# EasyEDA Pro project legacy_final.eprj, board PCB7
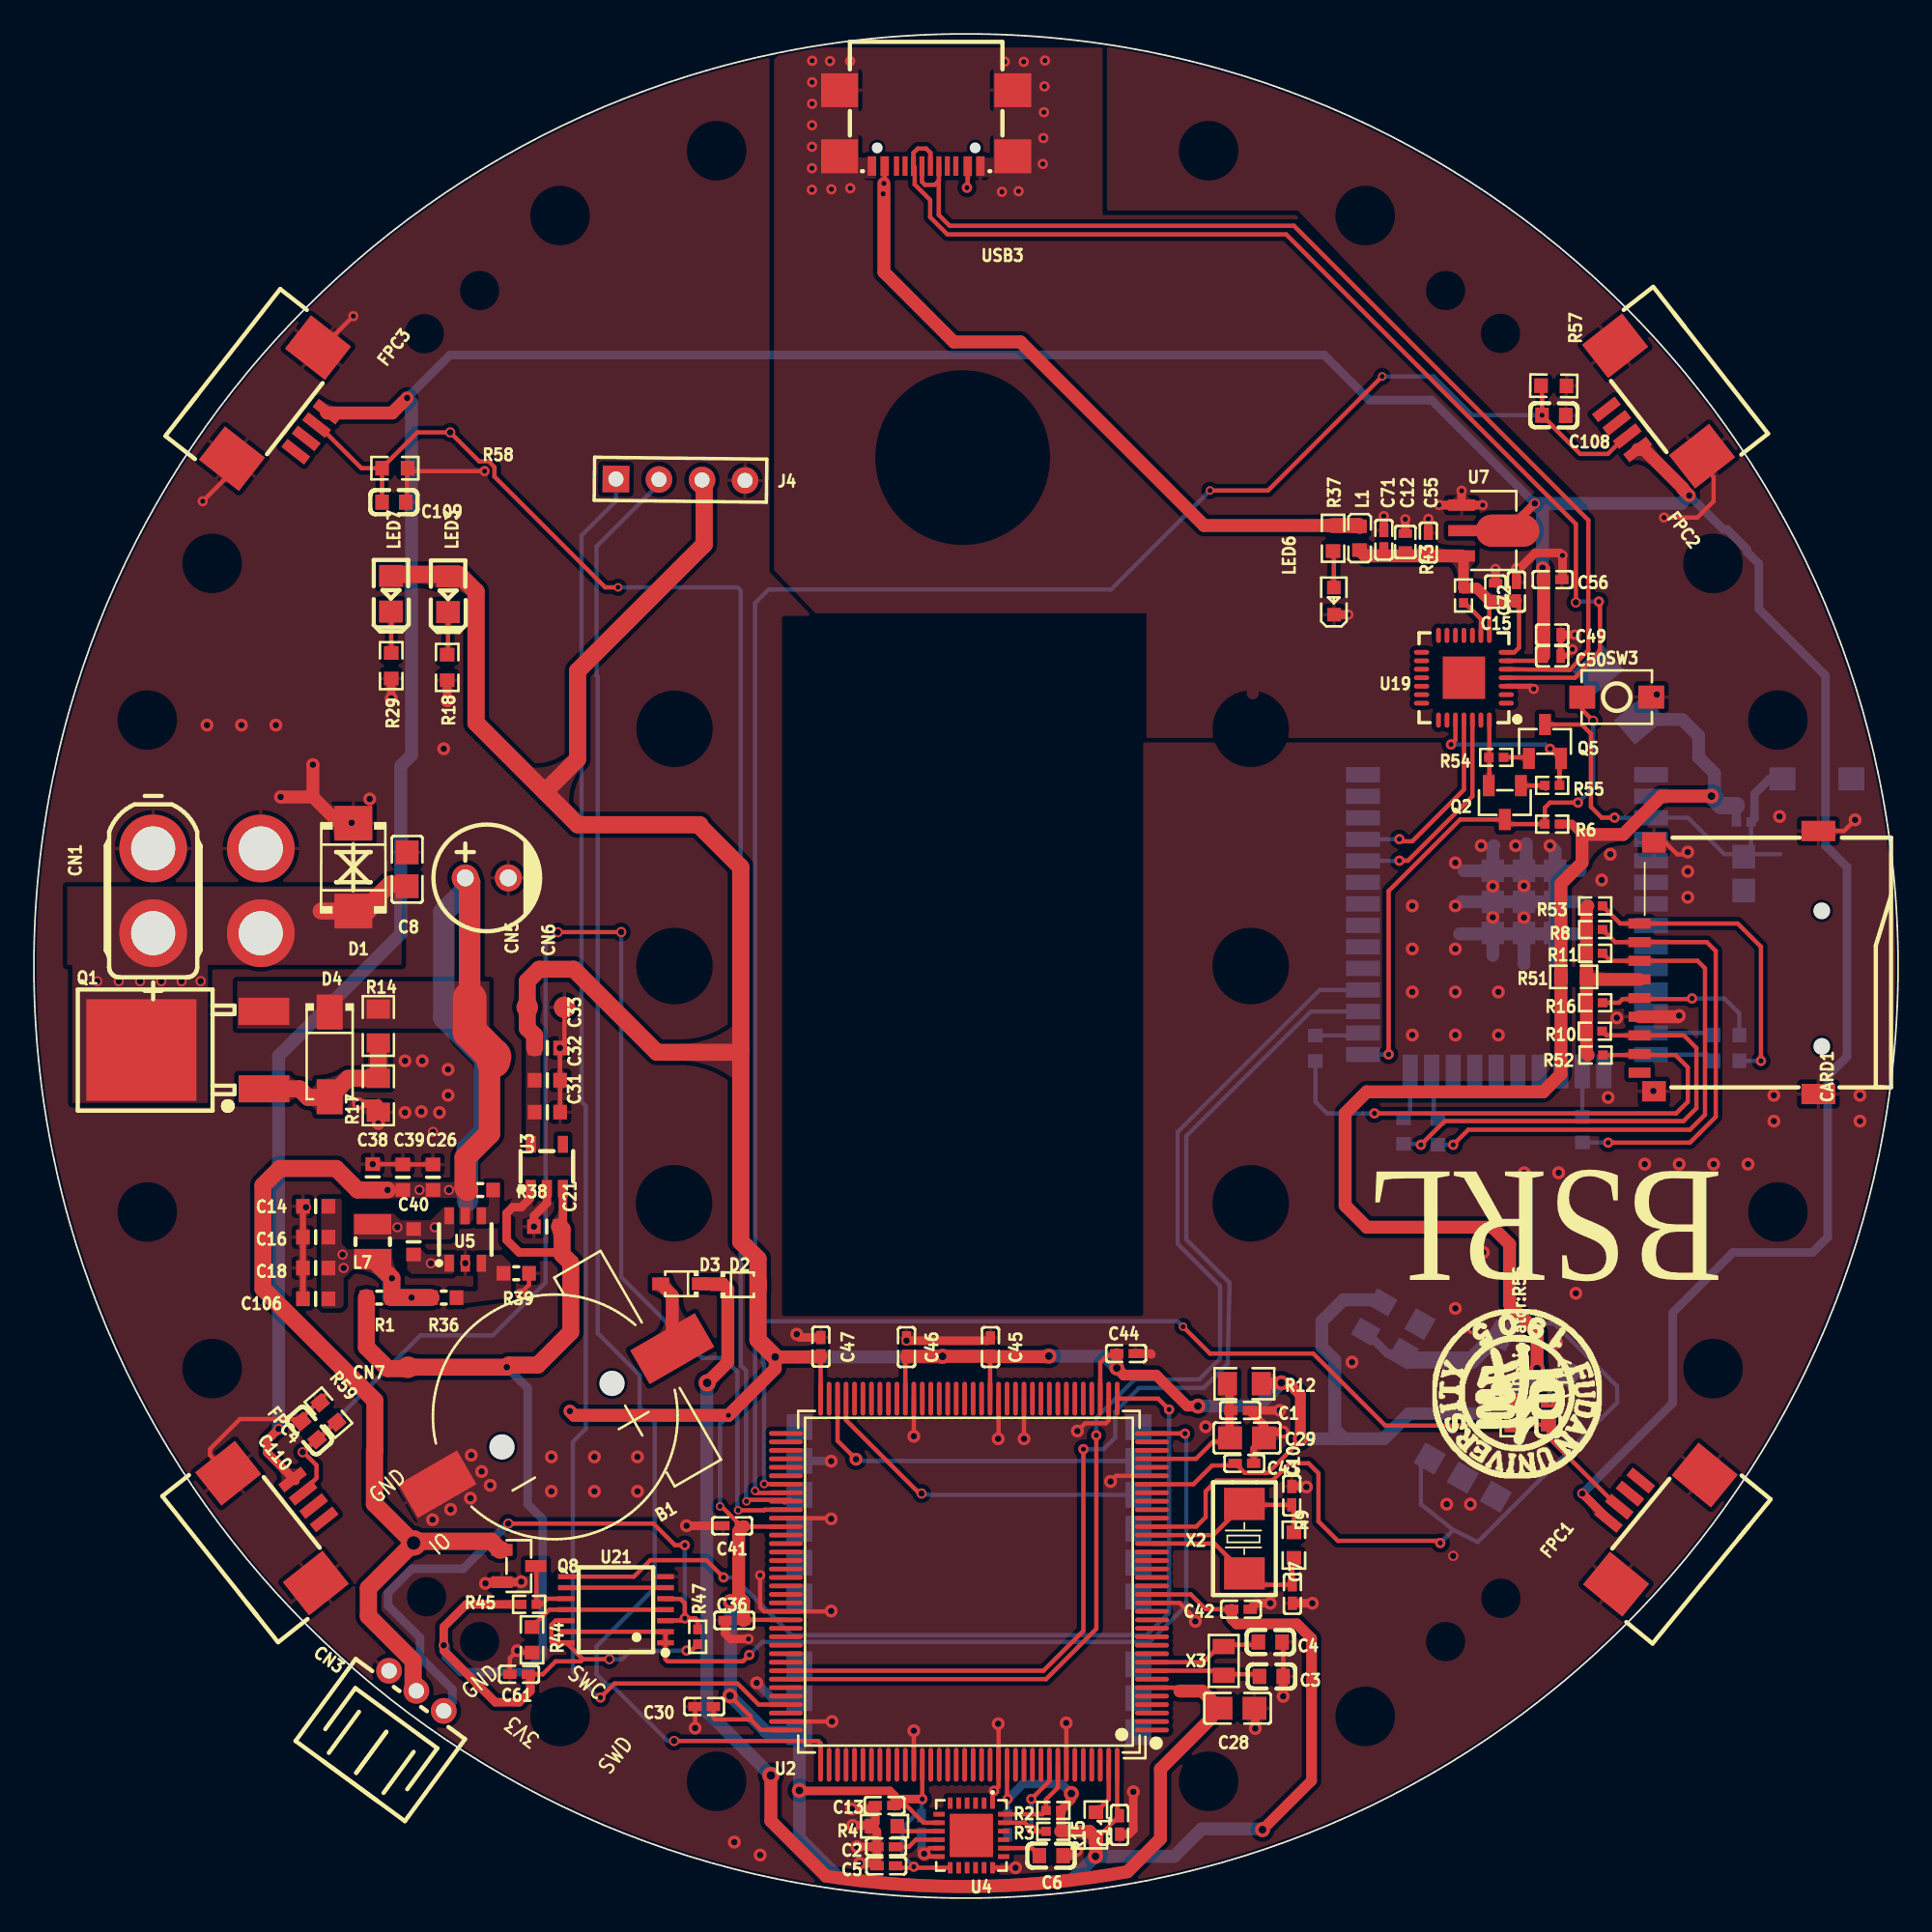
[diagram p1: board, top side]
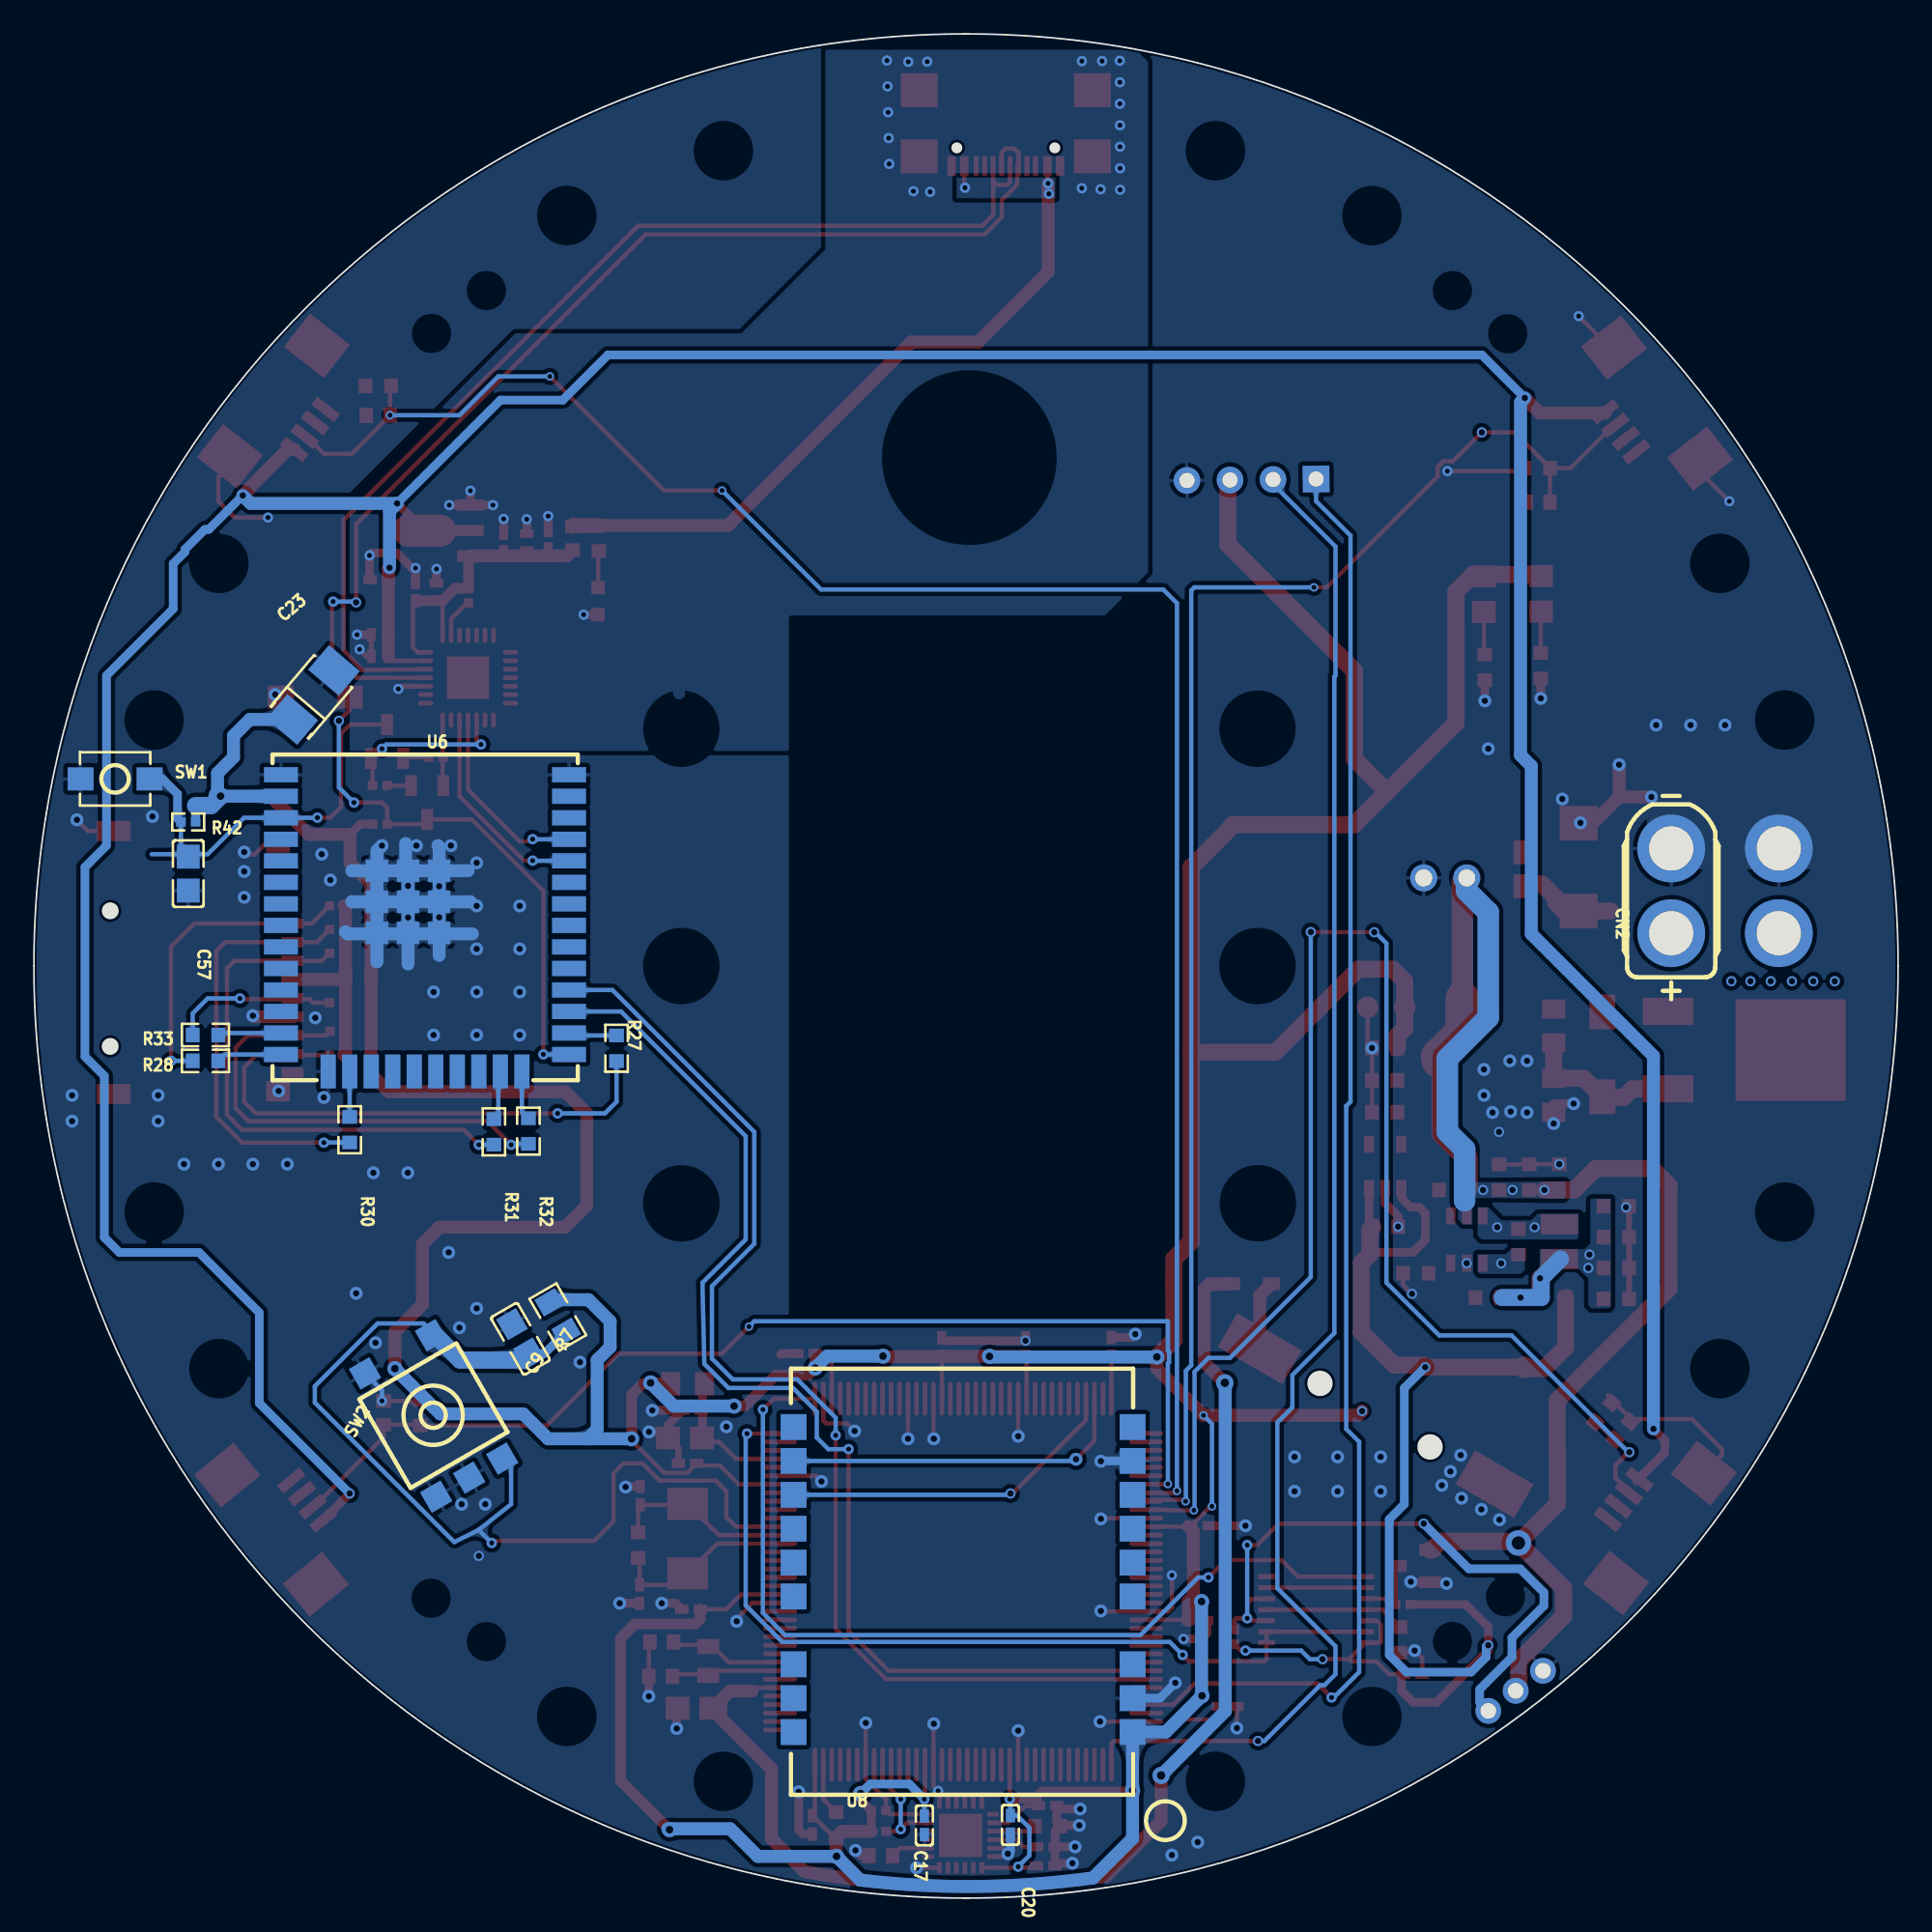
[diagram p2: board, bottom side, seen from below]

Outline 110 x 110 mm; copper layers: Top Layer, Bottom Layer. Coordinates in mm from the lower left corner of the outline.
Outline path: circle c55,55 r55
Stack: Top Layer 0.035mm - / Dielectric1 1.51mm FR4 er 4.5 / Bottom Layer 0.035mm -

## Design rules (mm)
template: 用户自定义配置
spacing safeClearance (default): track to track 0.152, other pairs 0.152 to 0.152
spacing Plane_innerPlane: track to track 0.152, other pairs 0.152 to 0.152
spacing Copper_copperRegion: track to track 0.152, other pairs 0.152 to 0.152
spacing Copper_copperRegion_Copper_copperRegion: track to track 0.152, other pairs 0.152 to 0.152
spacing Copper_copperRegion_safeClearance: track to track 0.152, other pairs 0.152 to 0.152
track width trackWidth (default): min 0.127, default 0.254, max 2.54
differential pair differentialPair (default): width min 0.127, default 0.254, max 2.54; gap min 0.152, default 0.152
via viaSize (default): diameter min 0.5, default 0.61, max 10; hole min 0.3, default 0.305, max 5.999
net GND uses copperRegion_safeClearance
net GND_USB uses copperRegion_safeClearance_1
net $1N28858 uses copperRegion_safeClearance
pour e1212 uses Copper_copperRegion_safeClearance, copperRegion_Copper_copperRegion_safeClearance
pour e1445 uses Copper_copperRegion_safeClearance, copperRegion_Copper_copperRegion_safeClearance
pour e1522 uses Copper_copperRegion, copperRegion_Copper_copperRegion_1
pour e1525 uses Copper_copperRegion, copperRegion_Copper_copperRegion_1

## Placement (name value [footprint] x y rotation side)
B1  CR1220-2  [BAT-SMD_CR1220-2]  30.74 28.42 210 top
C1  100nF  [C0402_NEW(1)]  71.17 28.78 0 top
C2  100nF  [C0402_NEW(1)]  50.29 3.03 180 top
C3  10pF  [C0603]  73.02 13.08 180 top
C4  10pF  [C0603]  72.95 15.11 180 top
C5  100nF  [C0402_NEW(1)]  50.29 1.91 180 top
C6  2.2nF  [C0603]  60.03 2.5 0 top
C7  22pF  [C0402]  74.26 17.94 90 top
C8  100nF  [C0805]  22.02 60.71 90 top
C9  100nF  [C0805]  81.29 33 240 bottom
C10  22pF  [C0402]  74.22 23.75 270 top
C11  100nF  [C0402_NEW(1)]  64.06 4.32 90 top
C12  10uF  [C0402(1)]  80.92 80.02 90 top
C13  100nF  [C0402_NEW(1)]  50.19 5.46 0 top
C14  100nF  [C0603_S]  16.64 40.82 0 top
C15  100nF  [C0402(1)]  86.24 77.08 90 top
C16  100nF  [C0603_S]  16.64 39 0 top
C17  100nF  [C0402_NEW(1)]  57.46 4.29 90 bottom
C18  100nF  [C0603_S]  16.64 37.18 0 top
C19  220uF  [CAP-TH_BD6.3-P2.50-D1.0-FD]  26.72 60.2 0 top
C20  100nF  [C0402_NEW(1)]  52.38 4.32 90 bottom
C21  100nF  [C0603_S]  30.27 39.62 0 top
C23  100uF  [CAP-SMD_L3.5-W2.8-R-RD]  93.53 70.99 310.3 bottom
C26  100nF  [C0603_S]  23.55 42.55 90 top
C28  100nF  [C0805]  71.02 11.2 180 top
C29  10uF  [C0805]  71.58 27.15 0 top
C30  100nF  [C0402_NEW(1)]  39.55 11.3 0 top
C31  100nF  [C0603_S]  30.29 46.38 180 top
C32  100nF  [C0603_S]  30.29 48.26 180 top
C33  100nF  [C0603_S]  30.29 50.16 180 top
C36  100nF  [C0402_NEW(1)]  41.33 16.38 0 top
C38  10uF  [C0603_S]  19.99 42.55 270 top
C39  10uF  [C0603_S]  21.77 42.55 90 top
C40  100nF  [C0603_S_3]  22.41 38.73 90 top
C41  100nF  [C0402_NEW(1)]  41.2 21.97 0 top
C42  100nF  [C0402_NEW(1)]  71.22 17.04 180 top
C43  100nF  [C0402_NEW(1)]  71.43 25.65 180 top
C44  100nF  [C0402_NEW(1)]  64.44 32.13 180 top
C45  100nF  [C0402_NEW(1)]  56.44 32.51 270 top
C46  100nF  [C0402_NEW(1)]  51.49 32.51 270 top
C47  100nF  [C0402_NEW(1)]  46.44 32.54 270 top
C49  100nF  [C0402(1)]  89.59 74.55 180 top
C50  10uF  [C0402(1)]  89.59 73.28 180 top
C55  10uF  [C0402_1]  82.28 79.99 270 top
C56  10uF  [C0402_1]  89.61 77.8 180 top
C57  10uF  [C0805_1]  100.89 60.45 90 bottom
C61  100nF  [C0402_NEW_1]  28.63 13.21 180 top
C71  100nF  [C0402_NEW_1]  79.65 80.16 270 top
C72  1uF  [C0402_1]  87.48 77.09 270 top
C106  100nF  [C0603_S]  16.64 35.36 0 top
C107  100nF  [C0603]  89.37 28.64 270 top
C108  100nF  [C0603]  89.69 87.49 179.5 top
C109  100nF  [C0603]  21.24 82.37 180 top
C110  100nF  [C0603]  16.25 27.59 310.5 top
CARD1  TF-01A  [TF-SMD_TF-01A]  100.02 55.21 90 top
CN1  Changzhou  [CONN-TH_XT30UPB-F]  7.04 59.44 90 top
CN2  Changzhou  [CONN-TH_XT30UPB-F(1)]  13.39 59.44 90 bottom
CN3  PH-3AW  [CONN-TH_PH-3AW]  22.57 12.23 323.8 top
CN5  5012  [TESTPOINT-TH_BD2.0_C9900010656]  29.11 52.57 90 top
CN6  5012  [TESTPOINT-TH_BD2.0_C9900010656]  31.31 52.57 90 top
CN7  5012  [TESTPOINT-TH_BD2.0_C9900010656]  22.08 31.33 0 top
D1  SMBJ36CA_C353363  [SMB_L4.6-W3.6-LS5.3-BI]  18.85 60.83 270 top
D2  1N4148WS T4  [SOD-323_L1.8-W1.3-LS2.5-RD]  41.58 36.2 0 top
D3  1N4148WS T4  [SOD-323_L1.8-W1.3-LS2.5-RD]  38.15 36.25 180 top
D4  SS54_C22452  [SMA_L4.4-W2.8-LS5.4-R-RD]  17.45 49.78 270 top
Designator:R56  -  [R0603]  87.21 28.64 270 top
FPC1  1.0K-FX-4PWBG  [CONN-SMD_1.0K-FX-4PWBG]  94.92 22.61 50.7 top
FPC2  1.0K-FX-4PWBG  [CONN-SMD_1.0K-FX-4PWBG]  94.8 87.5 128 top
FPC3  1.0K-FX-4PWBG  [CONN-SMD_1.0K-FX-4PWBG]  15.29 87.38 232 top
FPC4  1.0K-FX-4PWBG  [CONN-SMD_1.0K-FX-4PWBG]  15.11 22.68 308.4 top
J4  HDR-M-2.54_1x4  [HDR-M-2.54_1X4]  38.15 83.69 359.4 top
L1  2.7nH  [L0603]  78.22 80.24 270 top
L7  4.7uH  [IND-SMD_L2.5-W2.0]  19.99 38.73 90 top
LED3  whiteLEDSMD  [LED-0805]  24.44 76.94 90 top
LED6  XL-1608UBC-04  [LED0603-RD_BLUE]  76.71 76.53 90 top
LED7  whiteLEDSMD  [LED-0805]  21.07 76.96 90 top
Q1  NCE60P50K  [TO-252-2_L6.6-W6.1-P4.57-LS9.9-BR-CW]  9.96 50.04 0 top
Q2  S8050_C908252  [SOT-23-3_L2.9-W1.3-P1.90-LS2.4-BR]  86.79 64.64 90 top
Q5  S8050_C908252  [SOT-23-3_L2.9-W1.3-P1.90-LS2.4-BR]  89.16 68.25 270 top
Q8  LMUN2232LT1G  [SOT-23-3_L2.9-W1.3-P1.90-LS2.4-BR_1]  28.62 19.59 180 top
R1  0Ω  [R0603_S]  20.37 35.43 180 top
R2  10kΩ  [R0402]  60.15 5.17 0 top
R3  10kΩ  [R0402]  60.15 3.94 0 top
R4  4.7kΩ  [R0603]  50.19 4.24 0 top
R6  10k  [R0402_1]  89.59 63.37 0 top
R7  10K  [R0805]  79.09 34.29 60 bottom
R8  47k  [R0402_2]  92.13 57.15 180 top
R9  1M  [R0603]  74.35 20.83 270 top
R10  47k  [R0402_2]  92.1 51.16 180 top
R11  47k  [R0402_2]  92.13 55.75 180 top
R12  10  [R0805]  71.43 30.35 180 top
R14  47kΩ  [R0805]  20.32 51.46 90 top
R15  0  [R0603]  62.66 4.32 270 top
R16  47k  [R0402_2]  92.13 52.83 180 top
R17  10k  [R0805]  20.32 47.37 90 top
R18  1K  [R0603]  24.39 72.62 270 top
R27  0  [R0603_1]  75.62 50.15 90 bottom
R28  0  [R0603_1]  99.88 49.4 180 bottom
R29  1K  [R0603]  21.08 72.72 270 top
R30  0  [R0603_1]  91.37 45.34 90 bottom
R31  0  [R0603_1]  82.86 45.21 90 bottom
R32  0  [R0603_1]  80.82 45.26 90 bottom
R33  0  [R0603_1]  99.88 50.93 180 bottom
R36  62kΩ  [R0603_S]  24.18 35.43 0 top
R37  1k  [R0603]  76.66 80.24 270 top
R38  10kΩ  [R0603_S]  26.34 41.78 180 top
R39  12kΩ  [R0603_S]  28.46 36.87 0 top
R42  10k  [R0402_1]  100.89 63.5 180 bottom
R43  4.7k  [R0402_1]  84.35 76.86 270 top
R44  100k  [R0603_1]  29.39 15.24 90 top
R45  10k  [R0402_1]  29.22 17.33 180 top
R47  2k  [R0402_2]  39.17 15.42 90 top
R51  0  [R0603_1]  90.86 54.36 0 top
R52  47k  [R0402_2]  92.15 49.75 180 top
R53  47k  [R0402_2]  92.13 58.55 180 top
R54  10k  [R0402_1]  86.29 67.31 0 top
R55  10k  [R0402_1]  89.59 65.66 180 top
R57  10K  [R0603]  89.68 89.23 179.5 top
R58  10K  [R0603]  21.3 84.38 180 top
R59  10K  [R0603]  17.38 28.65 310.5 top
SW1  TSA343G00-250J2  [SW-SMD_L4.0-W2.9-LS5.0]  105.21 66.04 180 bottom
SW2  K2-1157SW-D4SB-04  [KEY-SMD_4P-L6.2-W6.5-P4.50-LS8.0_K2-1157SW-XX]  86.41 28.45 240 bottom
SW3  TSA343G00-250J2  [SW-SMD_L4.0-W2.9-LS5.0]  93.4 70.87 0 top
U2  STM32F407ZGT6  [LQFP-144_L20.0-W20.0-P0.50-LS22.0-BL]  55.17 18.67 90 top
U3  XC6210B332MR  [SOT-23-5_L3.0-W1.7-P0.95-LS2.8-BR]  30.27 43.18 270 top
U4  MPU-6050_C24112  [QFN-24_L4.0-W4.0-P0.50-BL-EP2.6]  55.32 3.7 180 top
U5  RY8411  [SOT-23-6_L2.9-W1.6-P0.95-LS2.8-BR]  25.45 38.86 270 top
U6  ESP32-WROOM-32UE(16MB)  [WIFI-SMD_ESP32-WROOM-32UE]  86.92 57.53 180 bottom
U7  AMS1117-3.3_C347256  [SOT-89_L4.5-W2.5-P1.50-LS4.2-BR]  85.6 80.7 180 top
U8  CH100  [CH100-18]  55.17 18.8 0 bottom
U19  CP2102-GMR  [CP2102]  84.38 72.01 90 top
U21  SN74HC125PWR  [TSSOP-14_L5.0-W4.4-P0.65-LS6.5-BL]  34.34 17.02 90 top
USB3  TYPE-C-31-M-22  [USB-C-SMD_TYPE-C-31-M-22]  52.65 104.44 180 top
X2  8MHz  [OSC-SMD_L5.0-W3.2]  71.43 21.21 270 top
X3  32.768kHz  [OSC-SMD_L2.0-W1.2]  70.21 14 270 top

## Footprints (pads in the part's own frame, mm; a bottom-side part is the same pattern mirrored in y, then rotated)
BAT-SMD_CR1220-2
  rect 4.4x2.3 smd: 1(-8,0)
  rect 4x2.3 smd: 2(8,0)
C0402
  rect 0.79x0.54 smd: 1(-0.545,0) 2(0.545,0)
C0402(1)
  rect 0.5x0.8 smd: 1(-0.5,0) 2(0.5,0)
C0402_1
  rect 0.79x0.54 smd: 1(-0.545,0) 2(0.545,0)
C0402_NEW(1)
  rect 0.79x0.54 smd: 1(-0.545,0) 2(0.545,0)
C0402_NEW_1
  rect 0.79x0.54 smd: 1(-0.545,0) 2(0.545,0)
C0603
  rect 0.8x0.9 smd: 1(-0.7,0) 2(0.7,0)
C0603_S
  rect 0.806x0.864 smd: 1(-0.762,0) 2(0.745,0)
C0603_S_3
  rect 0.806x0.864 smd: 1(-0.762,0) 2(0.745,0)
C0805
  rect 1.41x1.35 smd: 1(-1,0) 2(1,0)
C0805_1
  rect 1.41x1.35 smd: 1(-1,0) 2(1,0)
CAP-SMD_L3.5-W2.8-R-RD
  rect 1.9x2.376 smd: 1(1.899,0) 2(-1.899,0)
CAP-TH_BD6.3-P2.50-D1.0-FD
  round 1.6 hole 1: 1(-1.27,0) 2(1.27,0)
CH100-18
  rect 1.524x1.524 smd: 1(-10,9) 2(-10,7) 3(-10,5) 4(-10,1) 5(-10,-1) 6(-10,-3) 7(-10,-5) 8(-10,-7) 9(-10,-9) 10(10,-9) 11(10,-7) 12(10,-5) 13(10,-3) 14(10,-1) 15(10,1) 16(10,5) 17(10,7) 18(10,9)
CONN-SMD_1.0K-FX-4PWBG
  rect 0.6x1.7 smd: 1(-1.496,1.375) 2(-0.496,1.375) 3(0.504,1.375) 4(1.504,1.375)
  rect 2.5x3 smd: 5(-4.146,-1.375) 6(4.146,-1.342)
CONN-TH_PH-3AW
  round 1.524 hole 0.914: 1(2,0) 2(-0.002,0) 3(-2,0)
CONN-TH_XT30UPB-F
  round 4 hole 2.6: 1(-2.5,0) 2(2.5,0)
CONN-TH_XT30UPB-F(1)
  round 4 hole 2.6: 1(-2.5,0) 2(2.5,0)
CP2102
  oval 0.28x0.9 smd: 1(-1.502,-2.5) 2(-1.001,-2.5) 3(-0.5,-2.5) 4(0,-2.5) 5(0.5,-2.5) 6(1,-2.5) 7(1.501,-2.5) 15(1.501,2.5) 16(1,2.5) 17(0.5,2.5) 18(0,2.5) 19(-0.5,2.5) 20(-1.001,2.5) 21(-1.502,2.5)
  oval 0.9x0.28 smd: 8(2.5,-1.502) 9(2.5,-1.001) 10(2.5,-0.5) 11(2.5,0) 12(2.5,0.5) 13(2.5,1) 14(2.5,1.501) 22(-2.5,1.501) 23(-2.5,1) 24(-2.5,0.5) 25(-2.5,0) 26(-2.5,-0.5) 27(-2.5,-1.001) 28(-2.5,-1.502)
  rect 2.5x2.5 smd: 29(0,0)
HDR-M-2.54_1X4
  rect 1.575x1.575 hole 0.889: 1(-3.81,0)
  round 1.575 hole 0.889: 2(-1.27,0) 3(1.27,0) 4(3.81,0)
IND-SMD_L2.5-W2.0
  rect 1.2x2.2 smd: 1(1.028,0) 2(-1.028,0)
KEY-SMD_4P-L6.2-W6.5-P4.50-LS8.0_K2-1157SW-XX
  rect 1.4x1.4 smd: 1(-4.2,2.25) 2(4.2,2.25) 3(-4.2,-2.25) 4(4.2,-2.25) 5(4.2,0)
L0603
  rect 0.8x0.864 smd: 1(-0.7,0) 2(0.7,0)
LED0603-RD_BLUE
  rect 0.8x0.8 smd: 1(-0.799,-0.004) 2(0.799,0.004)
LED-0805
  rect 1.3x1.399 smd: 1(1.05,0) 2(-1.05,0)
LQFP-144_L20.0-W20.0-P0.50-LS22.0-BL
  oval 0.28x2 smd: 1(-8.75,-10.8) 2(-8.25,-10.8) 3(-7.75,-10.8) 4(-7.25,-10.8) 5(-6.75,-10.8) 6(-6.25,-10.8) 7(-5.75,-10.8) 8(-5.25,-10.8) 9(-4.75,-10.8) 10(-4.25,-10.8) 11(-3.75,-10.8) 12(-3.25,-10.8) 13(-2.75,-10.8) 14(-2.25,-10.8) 15(-1.75,-10.8) 16(-1.25,-10.8) 17(-0.75,-10.8) 18(-0.25,-10.8) 19(0.25,-10.8) 20(0.75,-10.8) 21(1.25,-10.8) 22(1.75,-10.8) 23(2.25,-10.8) 24(2.75,-10.8) 25(3.25,-10.8) 26(3.75,-10.8) 27(4.25,-10.8) 28(4.75,-10.8) 29(5.25,-10.8) 30(5.75,-10.8) 31(6.25,-10.8) 32(6.75,-10.8) 33(7.25,-10.8) 34(7.75,-10.8) 35(8.25,-10.8) 36(8.75,-10.8) 73(8.75,10.8) 74(8.25,10.8) 75(7.75,10.8) 76(7.25,10.8) 77(6.75,10.8) 78(6.25,10.8) 79(5.75,10.8) 80(5.25,10.8) 81(4.75,10.8) 82(4.25,10.8) 83(3.75,10.8) 84(3.25,10.8) 85(2.75,10.8) 86(2.25,10.8) 87(1.75,10.8) 88(1.25,10.8) 89(0.75,10.8) 90(0.25,10.8) 91(-0.25,10.8) 92(-0.75,10.8) 93(-1.25,10.8) 94(-1.75,10.8) 95(-2.25,10.8) 96(-2.75,10.8) 97(-3.25,10.8) 98(-3.75,10.8) 99(-4.25,10.8) 100(-4.75,10.8) 101(-5.25,10.8) 102(-5.75,10.8) 103(-6.25,10.8) 104(-6.75,10.8) 105(-7.25,10.8) 106(-7.75,10.8) 107(-8.25,10.8) 108(-8.75,10.8)
  oval 2x0.28 smd: 37(10.8,-8.75) 38(10.8,-8.25) 39(10.8,-7.75) 40(10.8,-7.25) 41(10.8,-6.75) 42(10.8,-6.25) 43(10.8,-5.75) 44(10.8,-5.25) 45(10.8,-4.75) 46(10.8,-4.25) 47(10.8,-3.75) 48(10.8,-3.25) 49(10.8,-2.75) 50(10.8,-2.25) 51(10.8,-1.75) 52(10.8,-1.25) 53(10.8,-0.75) 54(10.8,-0.25) 55(10.8,0.25) 56(10.8,0.75) 57(10.8,1.25) 58(10.8,1.75) 59(10.8,2.25) 60(10.8,2.75) 61(10.8,3.25) 62(10.8,3.75) 63(10.8,4.25) 64(10.8,4.75) 65(10.8,5.25) 66(10.8,5.75) 67(10.8,6.25) 68(10.8,6.75) 69(10.8,7.25) 70(10.8,7.75) 71(10.8,8.25) 72(10.8,8.75) 109(-10.8,8.75) 110(-10.8,8.25) 111(-10.8,7.75) 112(-10.8,7.25) 113(-10.8,6.75) 114(-10.8,6.25) 115(-10.8,5.75) 116(-10.8,5.25) 117(-10.8,4.75) 118(-10.8,4.25) 119(-10.8,3.75) 120(-10.8,3.25) 121(-10.8,2.75) 122(-10.8,2.25) 123(-10.8,1.75) 124(-10.8,1.25) 125(-10.8,0.75) 126(-10.8,0.25) 127(-10.8,-0.25) 128(-10.8,-0.75) 129(-10.8,-1.25) 130(-10.8,-1.75) 131(-10.8,-2.25) 132(-10.8,-2.75) 133(-10.8,-3.25) 134(-10.8,-3.75) 135(-10.8,-4.25) 136(-10.8,-4.75) 137(-10.8,-5.25) 138(-10.8,-5.75) 139(-10.8,-6.25) 140(-10.8,-6.75) 141(-10.8,-7.25) 142(-10.8,-7.75) 143(-10.8,-8.25) 144(-10.8,-8.75)
OSC-SMD_L2.0-W1.2
  rect 0.9x1.3 smd: 1(-0.85,0) 2(0.85,0)
OSC-SMD_L5.0-W3.2
  rect 1.9x2.4 smd: 1(-2.05,0) 2(2.05,0)
QFN-24_L4.0-W4.0-P0.50-BL-EP2.6
  rect 0.28x0.665 smd: 1(-1.25,-1.907) 2(-0.75,-1.907) 3(-0.25,-1.907) 4(0.25,-1.907) 5(0.75,-1.907) 6(1.25,-1.907) 13(1.25,1.907) 14(0.75,1.907) 15(0.25,1.907) 16(-0.25,1.907) 17(-0.75,1.907) 18(-1.25,1.907)
  rect 0.665x0.28 smd: 7(1.907,-1.25) 8(1.907,-0.75) 9(1.907,-0.25) 10(1.907,0.25) 11(1.907,0.75) 12(1.907,1.25) 19(-1.907,1.25) 20(-1.907,0.75) 21(-1.907,0.25) 22(-1.907,-0.25) 23(-1.907,-0.75) 24(-1.907,-1.25)
  rect 2.55x2.55 smd: 25(0,0)
R0402
  rect 0.566x0.54 smd: 1(-0.433,0) 2(0.433,0)
R0402_1
  rect 0.566x0.54 smd: 1(-0.433,0) 2(0.433,0)
R0402_2
  rect 0.566x0.54 smd: 1(-0.433,0) 2(0.433,0)
R0603
  rect 0.806x0.864 smd: 1(-0.753,0) 2(0.753,0)
R0603_1
  rect 0.806x0.864 smd: 1(-0.753,0) 2(0.753,0)
R0603_S
  rect 0.806x0.864 smd: 1(-0.752,0) 2(0.754,0)
R0805
  rect 1.133x1.377 smd: 1(-1,0) 2(1,0)
SMA_L4.4-W2.8-LS5.4-R-RD
  rect 2.062x1.539 smd: 1(2.503,0) 2(-2.503,0)
SMB_L4.6-W3.6-LS5.3-BI
  rect 2.047x2.241 smd: 1(-2.591,0) 2(2.591,0)
SOD-323_L1.8-W1.3-LS2.5-RD
  rect 1x0.75 smd: 1(-1.173,0) 2(1.173,0)
SOT-23-3_L2.9-W1.3-P1.90-LS2.4-BR
  rect 1.25x0.7 smd: 1(1,-0.95) 2(1,0.95) 3(-1,0)
SOT-23-3_L2.9-W1.3-P1.90-LS2.4-BR_1
  rect 1.25x0.7 smd: 1(1,-0.95) 2(1,0.95) 3(-1,0)
SOT-23-5_L3.0-W1.7-P0.95-LS2.8-BR
  rect 1x0.6 smd: 1(1.3,-0.95) 2(1.3,0) 3(1.3,0.95) 4(-1.3,0.95) 5(-1.3,-0.95)
SOT-23-6_L2.9-W1.6-P0.95-LS2.8-BR
  rect 1x0.55 smd: 1(1.4,-0.95) 2(1.4,0) 3(1.4,0.95) 4(-1.4,0.95) 5(-1.4,0) 6(-1.4,-0.95)
SOT-89_L4.5-W2.5-P1.50-LS4.2-BR
  rect 1.575x0.672 smd: 1(1.356,-1.5) 3(1.356,1.5)
  custom 5.377x1.9 smd: 2(-1.356,0.009)
SW-SMD_L4.0-W2.9-LS5.0
  rect 1.53x1.36 smd: 1(-2.035,0) 2(2.035,0)
TESTPOINT-TH_BD2.0_C9900010656
  round 1.27 smd: 1(0,0)
TF-SMD_TF-01A
  rect 0.6x1.3 smd: 1(2.3,5.276) 2(1.2,5.276) 3(0.101,5.276) 4(-1,5.276) 5(-2.099,5.276) 6(-3.2,5.276) 7(-4.3,5.276) 8(-5.399,5.276) 9(-6.5,5.276)
  rect 1.2x1.4 smd: 10(-7.599,4.426) 13(7.08,4.426)
  rect 1.2x2 smd: 11(-7.76,-5.276) 12(7.76,-5.276)
TO-252-2_L6.6-W6.1-P4.57-LS9.9-BR-CW
  rect 3x1.6 smd: 1(3.617,-2.285) 3(3.611,2.285)
  rect 6.5x6 smd: 2(-3.617,0)
TSSOP-14_L5.0-W4.4-P0.65-LS6.5-BL
  rect 0.305x0.991 smd: 1(-1.95,-2.925) 2(-1.3,-2.925) 3(-0.65,-2.925) 4(0,-2.925) 5(0.65,-2.925) 6(1.3,-2.925) 7(1.95,-2.925) 8(1.95,2.925) 9(1.3,2.925) 10(0.65,2.925) 11(0,2.925) 12(-0.65,2.925) 13(-1.3,2.925) 14(-1.95,2.925)
USB-C-SMD_TYPE-C-31-M-22
  rect 0.5x1.151 smd: 1(-3.2,2.237) 2(-2.451,2.237) 11(2.451,2.237) 12(3.2,2.237)
  rect 0.299x1.151 smd: 3(-1.75,2.237) 4(-1.25,2.237) 5(-0.752,2.237) 6(-0.252,2.237) 7(0.249,2.237) 8(0.75,2.237) 9(1.25,2.237) 10(1.75,2.237)
  rect 2.179x1.999 smd: 13(5.111,1.663) 14(5.111,-2.237) 15(-5.111,-2.237) 16(-5.111,1.663)
WIFI-SMD_ESP32-WROOM-32UE
  rect 2x0.9 smd: 1(-8.5,8.755) 2(-8.5,7.485) 3(-8.5,6.215) 4(-8.5,4.945) 5(-8.5,3.675) 6(-8.5,2.405) 7(-8.5,1.135) 8(-8.5,-0.135) 9(-8.5,-1.405) 10(-8.5,-2.675) 11(-8.5,-3.945) 12(-8.5,-5.215) 13(-8.5,-6.485) 14(-8.5,-7.755) 25(8.5,-7.755) 26(8.5,-6.485) 27(8.5,-5.215) 28(8.5,-3.945) 29(8.5,-2.675) 30(8.5,-1.405) 31(8.5,-0.135) 32(8.5,1.135) 33(8.5,2.405) 34(8.5,3.675) 35(8.5,4.945) 36(8.5,6.215) 37(8.5,7.485) 38(8.5,8.755)
  rect 0.9x2 smd: 15(-5.715,-8.755) 16(-4.445,-8.755) 17(-3.175,-8.755) 18(-1.905,-8.755) 19(-0.635,-8.755) 20(0.635,-8.755) 21(1.905,-8.755) 22(3.175,-8.755) 23(4.445,-8.755) 24(5.715,-8.755)
  rect 1.33x1.33 smd: 39(-2.835,-0.58) 39(-2.835,1.255) 39(-2.835,3.09) 39(-1,-0.58) 39(-1,1.255) 39(-1,3.09) 39(0.835,-0.58) 39(0.835,1.255) 39(0.835,3.09)

## Nets
As in the schematic, except:
+3.3V: C5.1 C11.2 C13.2 C17.2 C20.2 C23.1 C30.2 C31.2 C32.2 C33.2 C36.2 C41.2 C42.2 C43.2 C44.2 C45.2 C46.2 C47.2 CN5.1 D2.2 J4.3 LED3.1 LED7.1 R2.2 R3.2 R6.2 R7.2 R12.1 R15.2 R42.2 R51.1 U2.17 U2.30 U2.39 U2.52 U2.62 U2.72 U2.84 U2.95 U2.108 U2.121 U2.131 U2.144 U3.5 U4.8 U4.13 U6.2 U8.1
GND: B1.2 C1.2 C2.2 C3.1 C4.1 C5.2 C6.2 C7.1 C8.2 C9.1 C10.1 C11.1 C13.1 C14.1 C16.1 C17.1 C18.1 C19.2 C20.1 C21.1 C23.2 C26.2 C28.1 C29.2 C30.1 C31.1 C32.1 C33.1 C36.1 C38.1 C39.2 C41.1 C42.1 C43.1 C44.1 C45.1 C46.1 C47.1 C57.1 C61.2 C106.1 C107.1 C108.1 C109.1 C110.1 CARD1.6 CARD1.10 CARD1.11 CARD1.12 CARD1.13 CN1.2 CN2.2 CN3.3 CN6.1 D1.1 Designator:R56.1 FPC1.5 FPC1.6 FPC2.5 FPC2.6 FPC3.5 FPC3.6 FPC4.5 FPC4.6 J4.4 Q8.2 R4.1 R17.1 R18.2 R29.2 R39.2 R44.1 R57.1 R58.1 R59.1 SW1.1 SW2.3 SW2.4 SW2.5 SW3.2 U2.16 U2.31 U2.38 U2.48 U2.51 U2.61 U2.83 U2.94 U2.107 U2.120 U2.130 U2.138 U3.2 U4.1 U4.11 U4.12 U4.18 U5.2 U6.1 U6.15 U6.38 U6.39 U8.2 U8.8 U21.7
ADC_CH1: C107.2 Designator:R56.2 FPC1.2 U2.79
IO: CN3.1 R47.2 U21.3 U21.5

Pads without a net: CARD1 9; FPC1 3 4; FPC2 3 4; FPC3 3 4; FPC4 3 4; U2 1 2 3 4 5 7 10 11 12 22 32 49 50 53 54 55 56 57 58 59 60 63 64 65 66 67 68 71 85 86 87 88 89 90 91 92 93 96 97 103 104 106 114 115 117 118 119 122 123 124 125 126 127 128 129 132 140 141 142; U3 4; U4 2 3 4 5 6 7 14 15 16 17 19 21 22 25; U6 4 5 10 11 12 17 18 19 20 21 22 32 36 37; U8 3 4 5 6 7 9 10 13 14 15 16 17 18; U19 1 2 10 11 12 13 14 15 16 17 18 19 20 21 22 23 27 29; USB3 3 4 9 10

## Via types
v1: diameter 0.61, hole 0.305, Top Layer to Bottom Layer, 68 vias
v2: diameter 0.762, hole 0.381, Top Layer to Bottom Layer, 119 vias
v3: diameter 0.6, hole 0.3, Top Layer to Bottom Layer, 6 vias
v4: diameter 0.6, hole 0.381, Top Layer to Bottom Layer, 39 vias
v5: diameter 0.889, hole 0.457, Top Layer to Bottom Layer, 15 vias
v6: diameter 0.5, hole 0.3, Top Layer to Bottom Layer, 11 vias
v7: diameter 1.016, hole 0.508, Top Layer to Bottom Layer, 2 vias
v8: diameter 1.5, hole 0.8, Top Layer to Bottom Layer, 1 via
v9: diameter 0.6, hole 0.38, Top Layer to Bottom Layer, 4 vias

## Routing (per net, layer and track width the routed paths; a pad name or vN(x,y) marks a point on that pad's centre or on a via; arc(x,y) is an arc through that point)
3V3: length 246.2
  Top Layer w0.254: C50.2 88.82,73.01 U19.6
  Top Layer w0.508: v4(91.37,23.88) 92.91,22.33 92.91,22.32 ; v4(14.44,27.69) 13.77,27.02 13.77,26.29 15.43,24.62 ; v4(88.57,82.3) U7.2
  Top Layer w0.762: v4(89.02,78.5) 89.09,78.43 C49.2 C50.2 ; v4(22.02,88.52) 21.14,87.63 17.29,87.63 17.25,87.68 ; FPC2.1 95.01,85.48 97.3,83.19 97.3,83.14 v4(97.68,82.76)
  Bottom Layer w0.508: v4(88.57,82.3) 82.47,88.39 78.79,88.39 76.13,91.06 24.56,91.06 v4(22.02,88.52) ; v4(97.68,82.76) 99.68,80.76 99.91,80.76 101.09,79.58 101.09,79.43 101.78,78.74 101.78,76.07 105.72,72.14 105.72,62.1 106.99,60.83 106.99,49.66 105.84,48.51 105.84,38.99 104.96,38.1 100.26,38.1 96.7,34.54 96.7,29.21 v4(91.37,23.88)
  Bottom Layer w0.762: v4(97.68,82.76) 97.21,82.3 v4(88.57,82.3) 89.02,81.85 v4(89.02,78.5) ; v4(22.02,88.52) 22.28,88.27 22.28,67.44 21.64,66.8 21.64,56.9 14.44,49.69 v4(14.44,27.69)
+3.3V: length 422.5
  Top Layer w0.254: v5(41.07,11.94) 42.29,10.72 42.29,10.54 ; C44.2 63.8,32.03 63.35,32.03 62.92,31.6 U2.39 ; U2.72 46.42,31.97 ; U2.52 56.42,31.95 C45.2 ; v5(74.73,27.1) 74.73,27.05 ; U2.121 v1(52.42,5.84) ; U2.30 68.41,24.42 69.52,25.53 70.76,25.53 C43.2 71.44,25.09 72.82,25.09 74.73,27 ; C46.2 51.42,31.9 U2.62 ; 42.29,10.54 42.91,9.92 U2.108 ; 42.29,10.54 40.19,10.54 40.1,10.63 C30.2 ; C5.1 50.95,1.79 U4.13 ; v6(40.49,23.11) 40.57,23.11 41.59,22.1 41.87,22.1 ; U2.131 57.42,5.88 v1(57.46,5.84) ; 41.87,21.92 U2.84 ; U2.17 68.27,17.92 69.14,17.04 C42.2 ; U2.95 41.91,16.42 C36.2 ; 50.79,5.42 51.53,5.42 52.5,4.45 U4.8 ; R15.2 62.76,3.56 C11.2 63.92,5 U2.144
  Top Layer w0.508: v5(45.17,6.35) 45.2,6.32 50.5,6.32 50.79,6.03 50.79,5.42 51.21,5.84 v1(52.42,5.84) ; R6.2 90.74,63.37 91.35,62.76 ; v5(61.22,6.17) 61.22,5.8 R2.2 R3.2
  Top Layer w0.635: C42.2 70.68,16.47 70.97,16.18 74.53,16.18 75.39,15.32 75.39,6.93 v5(72.49,4.04) ; 74.68,27.05 v5(74.73,27.1) 74.73,29.69 74.07,30.35 R12.1 72.48,30.4 v5(73.61,30.4) ; 74.73,27.05 74.73,27 ; C44.2 v5(63.9,31.28) 64.32,30.86 66.22,30.86 68.05,29.03 v5(68.68,29.03)
  Top Layer w0.762: 41.87,21.92 41.58,21.63 41.58,17.8 41.87,17.51 ; v5(88.7,31.24) 88.7,33.4 87.07,35.03 87.07,38.58 86.07,39.59 78.65,39.59 77.37,40.87 77.37,46.3 78.64,47.57 89.05,47.57 90.1,48.62 R51.1 90.1,59.85 91.35,61.09 91.35,62.76 93.78,62.76 96.04,65.02 v5(98.99,65.02) ; C47.2 46.38,31.93 v5(43.74,31.93) 43.74,31.24 v6(40.98,28.48) 31.88,28.48 v4(31.63,28.74) ; C45.2 v5(53.62,31.97) C46.2 ; v5(59.9,31.98) 59.86,31.95 56.42,31.95 ; 41.87,17.51 41.86,17.5 v5(41.1,17.5) ; 41.87,17.51 C36.2 ; v5(62.64,2.46) 62.66,2.49 R15.2 62.29,3.94 R3.2
  Top Layer w1: C33.2 29.54,50.9 29.11,51.33 CN5.1 29.11,54.1 29.82,54.81 31.86,54.81 36.76,49.91 41.58,49.91 41.71,50.04
  Top Layer w1.016: J4.3 39.55,83.55 39.55,79.88 32.08,72.41 32.08,67.21 30.15,65.28 ; 39.3,63.34 32.09,63.34 30.15,65.28 ; 30.15,65.28 26.09,69.34 26.09,77.09 25.07,78.11 21.16,78.11 LED7.1 ; v5(43.74,31.93) 42.73,32.94 42.73,37.72 41.71,38.73 41.71,60.83 39.3,63.25
  Bottom Layer w0.254: v1(51.92,1.85) 51.26,2.51 51.26,4.15 51.97,4.86 C20.2 52.38,5.8 v1(52.42,5.84) ; v6(40.98,28.48) 40.49,27.99 v6(40.49,23.11) ; 57.33,4.86 57.46,4.99 v1(57.46,5.84)
  Bottom Layer w0.508: v1(57.46,5.84) 58.35,6.73 60.66,6.73 v5(61.22,6.17) ; 100.46,64.47 R42.2
  Bottom Layer w0.762: v5(74.73,27.1) 77.33,27.1 ; 77.33,27.1 79.66,27.1 81.13,28.58 86.03,28.58 v5(88.7,31.24) ; 77.33,27.1 76.76,27.67 76.76,31.75 76,32.51 76,34.04 77.27,35.31 79.43,35.31 R7.2 ; U6.2 98.99,65.02 ; 94.75,69.55 97.26,69.55 98.22,68.58 98.22,67.32 99.16,66.38 99.16,65.1 ; v5(43.74,31.93) 53.58,31.93 v5(53.62,31.97) ; 72.6,4.09 68.91,4.09 67.29,2.46 v5(62.64,2.46) 61.24,1.06 arc(54.37,0.69) 47.5,1.19 45.17,3.52 v5(45.17,6.35) U8.1 43.22,9.8 v5(41.07,11.94) 41.1,11.96 v5(41.1,17.5) 41.05,17.45 ; v5(59.9,31.98) 63.2,31.98 v5(63.9,31.28) ; v5(73.61,30.4) 72.24,29.03 v5(68.68,29.03)
  Bottom Layer w1.016: 99.16,65.1 99.08,65.02 99.16,65.02 ; 100.46,64.47 99.54,64.47 v5(98.99,65.02)
+5V: length 86.8
  Top Layer w0.254: R47.1 38.79,14.6 v1(38.51,14.6) ; 32.39,14.1 v4(33.96,14.1) ; 32.39,14.1 32.26,13.97 30.79,13.97 30.03,13.21 C61.1 ; 32.39,14.1 31.42,15.07 30.57,15.07 30.53,15.11 30.53,16.13 30.77,16.37 31.42,16.37
  Top Layer w0.5: U3.3 31.22,39.83 C21.2 ; v4(24.18,14.92) 24.18,16 25.51,17.33 R45.2 ; 31.05,38.1 28.63,38.1 27.89,38.83 27.89,40.41 28.25,40.77 28.76,40.77 29.26,41.28 29.26,41.83 U3.1
  Top Layer w0.508: 29.3,13.21 29.3,12.23 28.63,11.56 27.23,11.56 24.18,14.6 v4(24.18,14.92)
  Top Layer w1: R1.2 19.62,32.5 20.88,31.24 21.99,31.24 CN7.1 v4(27.9,31.33) 28.03,31.45 29.73,31.45 31.68,33.4 31.68,37.48 31.17,37.99 31.17,39.46 C21.2
  Bottom Layer w0.254: v1(38.51,14.6) 35.22,14.6 34.71,14.1 v4(33.96,14.1)
  Bottom Layer w0.508: 24.31,14.86 24.31,14.22 25.2,13.34 29.01,13.34 30.03,14.35 30.03,22.35 29.14,23.24 29.14,30.09 v4(27.9,31.33)
+12V: length 90.2
  Top Layer w1: 20.1,26.4 20.12,26.42 20.12,29.36 13.52,35.96 13.52,42.05 14.52,43.05 17.83,43.05 19.1,41.78 v4(20.87,41.78)
  Top Layer w1.016: 20.1,26.4 20.1,23.26 v8(22.4,20.96) ; v8(22.4,20.96) 19.74,18.29 19.74,16.64 22.38,14 22.38,12.29 22.44,12.23 CN3.2 ; v8(22.4,20.96) 22.5,21.05 26.98,21.05 27.49,20.54 Q8.1
  Top Layer w1.27: R38.2 25.58,41.78 25.45,41.91 25.45,43.69 26.88,45.11 26.88,49.4 27.11,49.4 ; 25.71,53.59 25.71,59.94 C19.1
  Top Layer w2: 27.17,49.66 27.11,49.72 ; 27.11,49.72 27.11,49.4 ; 27.11,49.72 25.71,51.12 25.71,53.09
  Bottom Layer w1.27: 25.58,41.15 25.58,44.2 26.6,45.21 26.6,49.54 24.18,51.95 24.18,58.17 25.45,59.44 C19.1
  vias: v4(22.75,41.79) v4(24.49,41.78)
GND: length 203.7
  Top Layer w0.254: U4.18 v2(57.92,1.79) ; U2.61 51.92,27.26 ; v4(19.99,43.31) 21.75,43.31 C39.2 C26.2 ; v3(9.96,82.42) 11.43,83.89 11.43,85.06 ; R44.1 28.65,14.49 v2(28.53,14.6) 28.08,14.16 C61.2 ; v2(56.9,27.1) 56.92,27.12 U2.51 ; 17.14,29.66 15.75,28.27 12.16,28.27 10.39,26.5 10.39,26.14 FPC4.5 ; v2(39.02,10.03) 39.02,11.29 C30.1 ; v3(26.6,84.2) 22.02,84.2 22.02,82.1 21.96,82.04 ; v2(56.9,10.29) 56.92,10.26 U2.130 56.92,6.6 v1(56.64,6.32) 56.57,6.25 U4.1 ; U2.38 63.42,28.19 63.25,28.02 62.03,28.02 v2(61.57,27.56) ; U2.83 47,22.42 v2(47.04,22.38) ; 105.3,62.97 106.8,62.97 v2(107.46,63.62) ; U2.16 67.6,17.42 68.53,16.48 v2(68.53,16.33) ; U2.31 63.86,24.92 v2(63.53,24.58) ; CN6.1 31.31,50.43 v2(31.04,50.17) 31.04,48.27 C32.1 C31.1 ; v3(42.85,19.05) 42.85,17.15 43.08,16.92 U2.94 47.02,16.92 v2(47.04,16.94) ; 99.07,83.9 99.11,83.85 99.11,82.42 98.15,81.46 v3(96.19,81.46) ; 29.22,36.79 29.22,36.19 v4(28.69,35.66) ; U2.120 51.92,9.88 ; 97.53,61.76 97.36,61.59 96.97,61.59 96.25,62.31 95.59,62.31 ; U4.12 52.7,2.45 v2(52.53,2.62) 52.86,2.95 U4.11 ; v2(60.91,10.34) 60.92,10.33 U2.138 ; U2.107 v2(47.09,10.42) ; 16.51,91.62 17.12,91.62 v3(18.85,93.34) ; C4.1 73.72,15.05 73.72,13.08 ; 87.05,29.28 87.75,29.28 87.81,29.34 v3(89.46,29.34) ; 58.42,29.47 v2(58.42,27.1)
  Top Layer w0.35: C106.1 C18.1 C16.1 15.87,40.58 v4(16.06,40.77)
  Top Layer w0.381: 71.97,25.65 71.97,26.55 C29.2
  Top Layer w0.5: U3.2 30.27,41.01 29.5,40.25 v4(29.5,39.62)
  Top Layer w0.508: v2(20.32,45.7) 20.32,46.88 v2(19.15,46.88) ; v2(73.72,11.9) 73.72,13.08 ; v2(64.87,6.27) 64.87,4.04 64.61,3.77 C11.1 ; C46.1 51.65,32.89 56.28,32.89 C45.1 ; C42.1 72.12,17.4 v2(72.95,17.4) ; 74.22,24.29 75.05,24.29 v2(75.08,24.26) ; 49.39,4.24 49.34,4.29 v2(48.31,4.29) ; C41.1 v2(38.51,21.97) ; v2(48.72,2.06) 49.6,2.06 C5.2 49.75,3.02 C2.2 ; v2(61.52,2.82) 61.21,2.5 C6.2 ; v2(72.07,10) 72.07,11.18 ; v2(24.39,70.65) 24.39,71.82 ; C36.1 40.78,15.63 41.13,15.29 v1(42.17,15.29) ; C2.2 49.74,3.94 R4.1 49.65,4.45 C13.1 49.44,5.26 v2(48.26,5.26) ; C2.2 v2(48.56,3.03) ; 65.94,32.08 65.89,32.13 C44.1 ; v2(73.71,27.51) 72.94,27.51 C29.2 72.58,27.92 C1.2 v2(73.51,28.78) ; v2(26.65,18.57) 26.72,18.64 Q8.2 28.73,18.64 v2(28.76,18.67) ; v2(21.08,70.79) R29.2 ; C47.1 45.2,33.08 v2(45.01,33.27) ; v2(75.44,17.4) C7.1
  Top Layer w0.762: 16.46,64.97 v2(14.56,64.97) ; 16.46,64.97 v2(16.46,66.88) ; 16.46,64.97 17.99,63.45 v2(18.75,63.45) ; v2(97.08,52.07) 97.02,52.01 CARD1.6
  Bottom Layer w0.254: SW2.3 89.46,29.96 v3(89.46,29.34)
  Bottom Layer w0.508: C20.1 52.38,2.77 v2(52.53,2.62) ; v2(47.04,25.78) 47.03,25.8 U8.8 ; U8.2 43.55,11.8 v2(42.65,12.7)
  Bottom Layer w0.762: 87.92,56.9 89.76,56.9 ; 87.92,56.9 U6.39 v2(87.92,57.86) U6.39 ; 87.92,56.9 87.92,55.12 ; 87.92,56.9 86.09,56.9 ; 89.76,56.9 89.76,55.25 ; 89.76,56.9 91.49,56.9 91.62,57.02 ; 89.76,56.9 U6.39 U6.39 ; U6.39 U6.39 ; U6.39 v2(87.92,59.73) U6.39 ; U6.39 U6.39 ; U6.39 88.06,60.76 88.06,62.23 ; U6.39 89.76,61.81 v2(89.46,62.1) ; U6.39 91.24,60.62 ; U6.39 U6.39 ; U6.39 84.38,60.62 ; U6.39 v2(86.09,59.7) U6.39 ; U6.39 86.09,62.03 86.16,62.1 ; U6.39 U6.39 ; U6.39 U6.39 ; U6.39 84.27,58.79 84.25,58.8 ; U6.39 v2(86.09,57.87) U6.39 86.09,56.9 ; U6.39 91.22,58.79 91.24,58.8 ; 86.09,56.9 86.09,55.63 ; 86.09,56.9 84.13,56.9
  vias: v2(10.21,69.22) v2(12.25,69.22) v2(14.28,69.22) v2(19.81,64.86) v2(21.9,49.4) v2(21.9,46.36) v2(22.86,46.41) v2(22.91,49.4) v2(23.52,22.33) v2(23.93,46.36) v2(24.18,67.82) v2(24.44,48.9) v2(24.44,47.37) v2(24.59,22.94) v2(25.76,23.6) v2(25.81,26.14) v2(26.42,25.17) v2(26.93,24.36) v2(30.53,26.03) v2(30.53,24) v2(33.07,26.03) v2(33.07,24) v2(35.61,26.03) v2(35.61,24) v2(41.33,3.3) v2(42.85,2.54) v2(51.92,27.25) v2(51.92,9.88) v2(69.14,27.81) v2(77.78,31.62) v2(81.33,58.55) v2(81.33,56.01) v2(81.33,53.47) v2(81.33,50.93) v2(83.37,23.24) v2(83.87,61.09) v2(83.87,58.55) v2(83.87,56.01) v2(83.87,53.47) v2(83.87,50.93) v2(83.87,34.8) v2(84.76,23.24) v2(84.89,33.66) v2(85.4,62.1) v2(85.52,38.1) v2(86.41,53.47) v2(86.41,50.93) v2(87.43,62.1) v2(87.94,42.8) v2(89.84,32.77) v2(89.97,42.8) v2(90.99,35.69) v2(92.51,60.07) v2(92.89,47.24) v2(93.02,61.59) v2(93.4,51.94) v2(95.05,43.31) v2(95.56,47.62) v2(95.76,71.02) v2(97.08,43.31) v2(97.59,61.72) v2(97.59,60.58) v2(97.59,59.06) v2(99.11,43.31) v2(101.15,43.31) v2(102.67,47.37) v2(102.67,45.85) v2(103.01,63.82) v2(107.75,47.37) v2(107.75,45.85) v4(23.55,45.21) v4(25.45,37.47) v4(51.49,32.89) v4(83.75,20.19)
GND_USB: length 16.9
  Top Layer w0.305: U19.3 88.34,71.51 v1(88.5,71.35) ; v1(90.78,73.69) 90.38,73.28 C50.1 C49.1
  Top Layer w0.508: v1(79.65,81.55) C71.1 ; v1(82.91,82.2) 83.76,82.2 ; v1(82.28,81.38) C55.1 ; v1(84.24,83.04) U7.1 ; v1(90.93,74.55) C49.1 ; v1(80.92,81.36) C12.2 ; 87.48,77.63 v1(87.48,78.48) 87.69,78.48 88.58,79.38 90.04,79.38 v1(90.19,79.23) 90.19,77.84 C56.1 ; v1(77.56,75.73) LED6.1 ; v1(85.49,82.2) 84.65,82.2 ; v1(86.24,78.43) C15.2
  vias: v1(45.93,108.41) v1(45.92,107.15) v1(45.92,105.88) v1(45.92,104.61) v1(45.91,103.34) v1(45.91,102.07) v1(45.91,100.8) v1(46.97,108.4) v1(47.06,100.83) v1(48.16,108.39) v1(48.17,100.89) v1(57.12,100.68) v1(57.29,108.36) v1(58.1,100.72) v1(58.41,108.35) v1(59.56,103.85) v1(59.53,102.33) v1(59.66,108.43) v1(59.63,106.9) v1(59.6,105.38)
VBAT: length 73.7
  Top Layer w0.254: U2.6 67.42,12.42 67.62,12.22
  Top Layer w0.762: D3.1 40.62,36.25 40.95,35.92 40.95,31.62 v7(39.73,30.4) ; v7(43.49,7.24) 43.49,4.55 46.74,1.3 arc(55.64,0.69) 64.53,1.56 66.47,3.5 66.47,7.62 69.47,10.61 69.47,11.69 68.94,12.22 67.62,12.22
  Bottom Layer w0.762: v7(39.73,30.4) 39.7,30.38 39.7,11.02 v7(43.49,7.24)
2OE: length 8.3
  Top Layer w0.254: R44.2 29.39,16 30.41,17.02 U21.4
3OE: length 3.8
  Top Layer w0.254: 31.04,17.67 30.29,17.67 29.96,17.33 R45.1 29.65,19.56 Q8.3
ADC_CH1: length 66.4
  Top Layer w0.254: FPC1.2 93.47,23.09 89.37,27.19 C107.2 87.26,27.94 Designator:R56.2 79.74,27.88 75.49,32.13 69.4,32.13 v6(67.81,33.72) ; U2.79 44.35,24.44 v6(43.09,24.44)
  Bottom Layer w0.254: v6(43.09,24.44) 43.09,31.56 43.02,31.63 43.02,32.23 43.09,32.3 43.09,34.02 43.11,34.04 67.49,34.04 v6(67.81,33.72)
ADC_CH2: length 115.3
  Top Layer w0.254: FPC2.2 93.92,86.27 92.87,85.22 91.24,85.22 89.65,86.81 89.65,86.84 v6(88.99,87.5) 88.99,89.18 88.93,89.24 ; v6(42.55,24.03) 42.68,23.91 44.26,23.91 ; v6(69.4,83.06) 72.82,83.06 v6(79.56,89.79)
  Bottom Layer w0.254: v6(42.55,24.03) 42.55,76.41 43.36,77.22 63.55,77.22 v6(69.4,83.06) ; v6(88.99,87.5) 84.89,87.5 82.6,89.79 v6(79.56,89.79)
ADC_CH3: length 89.8
  Top Layer w0.254: FPC3.2 16.78,86.92 19.32,84.38 R58.2 ; v6(34.47,77.34) 33.71,77.34 27.18,83.88 27.18,84.44 26.84,84.78 26.27,84.78 v9(24.56,86.49) 22.63,86.49 20.55,84.4 R58.2 ; R58.2 20.54,84.37 C109.2 ; 44.67,23.5 42.13,23.5 v6(42.04,23.41) ; 44.29,23.34 U2.81
  Bottom Layer w0.254: v6(42.04,23.41) 42.02,23.43 42.02,31.12 41.71,31.44 41.71,77.16 41.53,77.34 v6(34.47,77.34)
ADC_CH4: length 89.1
  Top Layer w0.254: 30.91,57 34.65,57 v9(34.66,57.01) ; 17.96,28.03 17.73,28.03 16.76,27.06 16.64,27.06 16.04,26.46 16.04,26.42 ; 16.01,24.12 16.68,24.79 16.68,25.54 15.85,26.36 ; v6(41.55,22.88) 43.08,22.88 43.12,22.92 U2.82
  Bottom Layer w0.254: 15.91,26.31 22.81,33.2 27.08,33.2 30.19,36.32 30.19,56.34 30.85,56.99 ; v9(34.66,57.01) 34.66,36.65 39.42,31.88 40.69,31.88 41.51,31.06 41.51,22.92 v6(41.55,22.88)
  vias: v9(15.86,26.31) v9(30.91,56.99)
D0: length 27.7
  Top Layer w0.254: v1(81.84,44.45) 83.24,45.85 97.34,45.85 98.1,46.61 98.1,50.17 97.36,50.91 CARD1.7 92.79,50.91 R10.1
  Bottom Layer w0.254: v1(81.84,44.45) 81.79,44.51 R32.1
D1: length 32.4
  Top Layer w0.254: 94.68,49.75 R52.1 ; 94.68,49.75 96.87,49.75 97.59,49.02 97.59,46.99 96.9,46.3 v1(79.1,46.3) 79.05,46.36 ; 94.68,49.75 CARD1.8
  Bottom Layer w0.254: v1(79.1,46.3) 76.3,46.3 75.62,46.99 R27.1
D2: length 18.4
  Top Layer w0.254: R53.1 93.6,57.51 CARD1.1 100.53,57.51 101.91,56.13 v1(101.91,49.4)
  Bottom Layer w0.254: v1(101.91,49.4) R28.1
D3: length 25.5
  Top Layer w0.254: v1(92.89,44.58) 97.72,44.58 99.24,46.1 99.24,55.88 98.71,56.41 CARD1.2 93.3,56.41 R8.1
  Bottom Layer w0.254: R30.1 92.88,44.59 v1(92.89,44.58)
D+: length 67
  Top Layer w0.254: U19.4 90.93,72.01 92.41,73.58 92.36,73.62 92.41,73.67 92.41,76.44 v1(92.34,76.5) ; USB3.6 52.9,102.98 52.65,103.24 52.15,103.24 51.9,102.98 51.9,102.2 51.97,102.13 51.97,101.12 52.89,100.2 52.89,99.19 53.9,98.17 73.89,98.17 90.99,81.08 v4(90.99,76.45)
  Bottom Layer w0.254: v4(90.99,76.45) 91.03,76.5 v1(92.34,76.5)
D-: length 63.8
  Top Layer w0.254: USB3.5 53.4,101.35 53.39,101.34 ; USB3.7 52.4,101.27 52.58,101.09 53.15,101.09 53.39,101.34 ; 53.39,101.34 53.39,99.31 54.03,98.68 74.35,98.68 91.72,81.31 91.72,73.64 90.63,72.47 U19.5
DTR: length 3.9
  Top Layer w0.254: U19.28 85.88,65.68 Q2.2
EN: length 25.6
  Top Layer w0.254: v1(93.27,63.75) 92.51,63.75 91.87,64.39 91.87,68.71 91.33,69.25 Q5.3
  Bottom Layer w0.254: 101.03,61.59 101.32,61.89 R42.1 ; 101.03,61.59 103.05,61.59 ; 101.03,61.59 C57.2 ; 101.03,61.59 99.75,61.59 97.6,63.75 U6.3 93.28,63.75 v1(93.27,63.75)
  Bottom Layer w0.508: R42.1 101.53,63.7 101.53,65.15 102.42,66.04 SW1.2
I2C1_SCL: length 7
  Top Layer w0.254: U2.136 59.92,6.91 v1(58.85,5.84) ; U4.23 58.47,4.45 v1(58.85,4.06) 58.98,3.94 R3.1
  Bottom Layer w0.254: v1(58.85,4.06) v1(58.85,5.84)
I2C1_SDA: length 5.6
  Top Layer w0.254: U4.24 59.5,4.95 R2.1 59.72,5.82 60.42,6.52 U2.137
IO: length 37.7
  Top Layer w0.254: v1(38.41,16.51) 38.28,16.38 37.28,16.38 U21.3 ; v1(38.41,16.51) 38.41,17.4 38.15,17.65 37.28,17.65 U21.5 ; v1(38.41,16.51) 39.04,16.51 39.17,16.38 R47.2 39.17,15.75 39.12,15.7 ; v4(27.99,22.1) 36.55,22.1 37.82,20.83 v1(38.41,20.83)
  Bottom Layer w0.254: 38.51,16.48 38.41,16.59 v1(38.41,20.83)
  Bottom Layer w0.508: 27.99,22.1 25.33,19.43 22.3,19.43 20.9,18.03 20.9,17.25 22.79,15.37 22.79,14.22 24.69,12.32 24.69,11.56 24.18,11.05
IO0: length 31.9
  Top Layer w0.254: v1(91.11,64.64) 89.46,64.64 89.16,64.34 R6.1 ; SW3.1 91.36,70.11 v4(92,69.47) ; 88.9,63.37 87.06,63.37 Q2.3 84.15,63.64 79.94,59.42 v1(79.94,49.78)
  Bottom Layer w0.254: v1(79.94,49.78) 79.93,49.78 U6.25 ; v1(91.11,64.64) 92,65.53 v4(92,69.47)
IO2: length 2.9
  Bottom Layer w0.254: R32.2 81.21,46.4 U6.24
IO4: length 2.9
  Bottom Layer w0.254: U6.26 78.27,50.9 R27.2
IO12: length 3.9
  Bottom Layer w0.254: U6.14 98.75,49.78 R28.2
IO13: length 2.7
  Bottom Layer w0.254: U6.16 R30.2
IO14: length 3.7
  Bottom Layer w0.254: R33.2 99,51.05 U6.13
IO15: length 2.9
  Bottom Layer w0.254: U6.23 82.6,48.66 82.6,45.96
POWER_IN: length 5.9
  Top Layer w1: 22.02,59.83 21.01,59.83 20.2,59.02 20.2,58.73 19.71,58.24 16.94,58.24
  vias: v4(3.74,54.1) v4(5.01,54.1) v4(6.27,54.1) v4(7.52,54.1) v4(8.71,54.1) v4(9.84,54.1)
RESET: length 61.7
  Top Layer w0.254: v1(82.98,20.96) 82.86,21.08 76.94,21.08 75.8,22.22 75.8,25.07 75.21,25.65 74.09,25.65 73.08,24.64 69.78,24.64 69.14,24 69.14,22.48 68.58,21.92 U2.25
  Bottom Layer w0.254: 83.75,21.72 81.84,23.24 81.84,25.67 82.24,26.06 ; 83.75,21.72 85.18,21.01 85.21,21.02 93.42,29.24 93.42,30.2 89.72,33.91 87.01,33.91 86.44,33.34 ; 83.75,21.72 v1(82.98,20.96)
  Bottom Layer w0.5: C9.2 79.87,32.13 R7.1
  Bottom Layer w1.016: 86.44,33.34 84.85,31.75 81.18,31.75 C9.2
RTS: length 10
  Top Layer w0.254: v1(89.46,67.82) 90.03,67.25 Q5.2 90.02,67.16 R55.1 ; v1(83.62,68.07) 83.88,68.33 U19.24
  Bottom Layer w0.254: v1(83.62,68.07) 89.21,68.07 v1(89.46,67.82)
RXD: length 5.8
  Top Layer w0.254: 31.42,18.32 U21.6
RXD_CH: length 12.5
  Top Layer w0.254: v1(80.57,61.21) 81.08,61.21 84.88,65.02 U19.26
  Bottom Layer w0.254: v1(80.57,61.21) 80.56,61.21 U6.34
SD_3V3: length 12.1
  Top Layer w0.762: R51.2 91.76,54.21 CARD1.4 ; R51.2 91.61,58.46 R53.2 ; R51.2 91.61,49.85 R52.2
SDCLK: length 9.9
  Top Layer w0.254: 94.68,53.05 97.8,53.05 v1(97.84,53.09) ; 94.68,53.05 93.74,53.05 93.53,52.83 R16.1 ; 94.68,53.05 CARD1.5
  Bottom Layer w0.254: v1(97.84,53.09) 99.75,53.09 100.63,52.21 R33.1
SDCMD: length 31.8
  Top Layer w0.254: v1(83.75,44.45) 84.64,45.34 97.72,45.34 98.61,46.23 98.61,54.86 98.16,55.31 CARD1.3 93.01,55.31 R11.1
  Bottom Layer w0.254: v1(83.75,44.45) 83.74,44.46 82.6,44.46
SWCLK: length 91
  Top Layer w0.254: U2.109 46.42,9.13 46.28,9.27 v4(37.77,9.27)
  Bottom Layer w0.254: v4(37.77,9.27) 37.39,9.27 34.09,12.57 33.84,12.57 33.2,13.21 33.2,14.86 36.63,18.29 36.63,28.07 35.74,28.96 35.74,30.86 33.27,33.33 33.27,72.07 33.2,72.14 33.2,79.76 36.88,83.44 J4.2
SWDIO: length 85.7
  Top Layer w0.254: v1(33.43,11.84) 34.25,12.66 41.52,12.66 42.76,11.42 U2.105
  Bottom Layer w0.254: 34.34,83.74 34.34,82.43 32.31,80.4 32.31,46.99 32.57,46.74 32.57,27.69 31.8,26.92 31.8,13.34 33.33,11.81 33.4,11.81 v1(33.43,11.84)
TXD_CH: length 11.1
  Top Layer w0.254: U19.25 84.38,65.41 81.33,62.36 80.83,62.36
  Bottom Layer w0.254: v1(80.57,62.48) 80.56,62.48 U6.35
USART1_RX: length 69.6
  Top Layer w0.254: U2.102 59.72,12.92 62.69,15.89 v1(62.69,27.31)
  Bottom Layer w0.254: U6.28 75.86,53.59 67.49,45.21 67.49,38.61 69.99,36.11 69.99,31.84 68.76,30.61 64.95,30.61 62.69,28.35 v1(62.69,27.31)
USART1_TX: length 68.7
  Top Layer w0.254: U2.101 59.57,13.42 61.93,15.77 v1(61.93,26.49)
  Bottom Layer w0.254: v1(61.93,26.49) 63.12,26.49 63.81,27.18 63.81,28.7 65.2,30.1 69.01,30.1 70.44,31.52 70.55,36.31 68,38.86 68,44.96 75.36,52.32 U6.27
USART2_RX: length 53.7
  Top Layer w0.254: 31.42,18.97 35.4,18.97 36.38,19.94 39.68,19.94 v1(40.69,18.92) ; v1(66.98,28.83) 66.34,29.47 U2.37
  Bottom Layer w0.254: v1(66.98,28.83) 66.98,16.83 65.67,15.52 44.71,15.52 41.3,18.92 v1(40.69,18.92)
USART2_TX: length 51.7
  Top Layer w0.254: v1(67.92,27.41) 67.91,27.42 U2.36 ; 31.42,15.72 U21.2 37.26,15.71 37.26,14.1 37.39,13.97 41.84,13.97 v1(42.22,14.35)
  Bottom Layer w0.254: v1(42.22,14.35) 42.98,15.11 65.84,15.11 68,17.27 68,27.33 v1(67.92,27.41)
USART3_RX: length 20.7
  Top Layer w0.254: U2.70 47.42,26.99 v2(48.51,25.9)
  Bottom Layer w0.254: v2(48.51,25.9) 48.61,25.8 U8.11
USART3_TX: length 20.3
  Top Layer w0.254: U2.69 47.92,28.21 52.25,23.88 v4(52.38,23.88)
  Bottom Layer w0.254: U8.12 52.46,23.8 v4(52.38,23.88)
V_BUS: length 41.8
  Top Layer w0.254: USB3.2 55.1,100.97 v1(55.06,100.92) ; v1(50.16,101.18) 50.2,101.22 USB3.11
  Top Layer w0.762: v1(50.16,101.18) 50.16,95.95 54.28,91.82 58.22,91.82 69.05,80.99 R37.1
  Top Layer w0.889: L1.1 78.17,80.99 R37.1
  vias: v1(50.11,100.56)
V_BUS_5V: length 18.9
  Top Layer w0.254: U19.8 85.88,76.42 86.04,76.58 ; U19.7 87.36,73.51 87.63,73.79 87.63,76.21 87.3,76.54 87.27,76.58 C15.1
  Top Layer w0.635: C72.2 86,76.54 85.89,76.58 ; 85.89,76.58 C15.1 ; 85.89,76.58 85.85,76.58 85.14,77.29 84.35,77.29 84.35,79.09 U7.3
  Top Layer w0.762: U7.3 78.56,79.2 L1.2
$1N14267: length 2.4
  Top Layer w0.254: R29.1 21.08,75.9 LED7.2
$1N14270: length 2.5
  Top Layer w0.254: LED3.2 24.44,73.42 R18.1
$1N14330: length 2.6
  Top Layer w0.254: U4.9 51,3.95 50.83,4.11
$1N14338: length 2.8
  Top Layer w0.254: C2.1 50.84,3.02 51.62,3.02 52.04,3.45 U4.10
$1N14340: length 2.3
  Top Layer w0.254: U4.20 58.88,2.95 C6.1
$1N14347: length 4.1
  Top Layer w0.762: B1.1 37.66,35.56 D3.2
$1N14377: length 1.5
  Top Layer w0.254: Q2.1 89.02,65.64 89.21,65.46
$1N14378: length 1.5
  Top Layer w0.254: R54.2 88.15,67.31 Q5.1
$1N14385: length 2.2
  Top Layer w0.254: LED6.2 76.71,79.44 R37.2
$1N14386: length 10.9
  Top Layer w0.254: U2.23 69.67,20.92 X2.2 72.1,18.49 C7.2 74.26,19.98 R9.2
$1N14387: length 10.7
  Top Layer w0.254: U2.24 69.59,21.42 X2.1 71.48,23.2 C10.2 74.35,23.08 R9.1
$1N14408: length 6.9
  Top Layer w0.254: U2.9 69,13.92 70.03,14.95 72.22,14.95 72.38,15.11
$1N14410: length 8.5
  Top Layer w0.254: 70.55,26.92 69.57,26.92 68.57,25.92 U2.33
  Top Layer w0.508: 70.55,26.92 70.55,30.23 R12.2
$1N14458: length 9.5
  Top Layer w1: Q1.1 15.67,47.75 16.18,47.24 17.42,47.24 D4.1 18.54,48.37 R17.2 R14.1
$1N14472: length 6.5
  Top Layer w0.254: U2.8 69.86,13.42 70.07,13.21 72.19,13.21 C3.2
$1N14474: length 3.1
  Top Layer w0.254: U2.143 63.42,5.83 R15.1
$1N14488: length 2.4
  Top Layer w0.254: U19.9 85.38,75.48 84.43,76.43 R43.2
$1N28855: length 10.1
  Top Layer w1: L7.2 v4(21.13,36.57) R1.1 v4(22.28,35.43) R36.1
  Bottom Layer w1: 23.36,35.44 21.06,35.44 21.06,36.58 19.92,37.71
  vias: v4(18.21,37.97) v4(18.28,37.18)
$1N28858:
  vias: v4(21.45,39.59) v4(23.66,39.59)
$1N28859:
  vias: v4(23.42,37.46)

## Copper pours and planes (outline as drawn; the poured copper is in the pictures)
+3.3V on Top Layer: 29.03,50.55 29.9,50.55 29.9,44.08 29.03,44.08
+12V on Top Layer: 19.57,42.29 25.93,42.29 25.93,39.75 19.57,39.75
+12V on Top Layer: 11.99,54.1 26.88,54.1 26.88,51.31 11.99,51.31
+12V on Bottom Layer: 19.61,42.29 25.97,42.29 25.97,39.75 19.61,39.75
GND on Top Layer: 21.12,27.41 27.68,27.41 27.68,21.87 21.12,21.87
GND on Top Layer: -11.88,112.14 120.2,112.14 120.58,111.76 120.58,-0.89 114.99,-6.48 -10.23,-6.48 -10.61,-6.1 -10.61,41.02 -26.24,56.64 -11.88,70.99
GND on Top Layer: 21.39,49.92 24.82,49.92 24.82,46.07 21.39,46.07
GND on Bottom Layer: 2.61,65.15 14.82,65.15 14.82,60.7 2.61,60.7
GND on Bottom Layer: -20.52,111.12 138.36,111.12 139.63,109.86 139.63,5.84 132.26,-1.52 -13.03,-1.52 -13.54,-1.02 -13.54,104.14
GND_USB on Top Layer: 44.39,109.19 63.06,109.19 63.06,99.31 74.48,99.31 81.01,92.46 91.42,82.04 91.42,68.45 65.64,68.45 65.64,75.82 46.11,75.82 43.67,78.36 43.67,108.48
GND_USB on Top Layer: 45.34,108.88 48.66,108.88 48.66,100.2 45.34,100.2
GND_USB on Top Layer: 55.6,102.7 57.11,102.7 57.11,101.54 55.6,101.54
GND_USB on Top Layer: 48.17,102.71 49.68,102.71 49.68,101.46 48.17,101.46
GND_USB on Top Layer: 56.61,108.77 60.13,108.77 60.13,100.09 56.61,100.09
GND_USB on Bottom Layer: 44.96,109.07 63.3,109.07 63.3,97.28 68.25,92.33 81.59,92.33 91.37,82.55 91.37,67.69 65.33,67.69 65.33,75.69 46.79,75.69 44.25,78.23 44.25,108.35
POWER_IN on Top Layer: 1.96,59.69 21.7,59.69 21.7,55.06 1.96,55.06
POWER_IN on Top Layer: 2.27,56.93 10.26,56.93 10.26,46.91 2.27,46.91
V_BUS on Bottom Layer: 49.74,101.52 55.55,101.52 55.55,100.3 49.74,100.3
$1N28853 on Top Layer: 26.14,42.18 27.49,42.18 27.49,39.79 26.14,39.79
$1N28855 on Top Layer: 16.94,41.28 21.15,41.28 21.15,34.8 16.94,34.8
$1N28855 on Bottom Layer: 16.94,41.28 21.15,41.28 21.15,34.8 16.94,34.8
$1N28856 on Top Layer: 24.54,37.97 28.17,37.97 28.17,34.98 24.54,34.98
$1N28858 on Top Layer: 18.85,40.77 24.82,40.77 24.82,38.86 18.85,38.86
$1N28858 on Bottom Layer: 18.85,40.77 24.82,40.77 24.82,38.86 18.85,38.86
$1N28859 on Top Layer: 22.02,38.36 24.82,38.36 24.82,36.83 22.02,36.83
$1N28859 on Bottom Layer: 22.02,38.36 24.82,38.36 24.82,36.83 22.02,36.83

Small or netless copper shapes (teardrops, artwork), in the pictures only: 461 on Top Layer, 159 on Bottom Layer

## Text on the board
Top Silkscreen Layer: GND | IO | SWD | 3V3 | SWC | BSRL
